# Altium schematic sheet 002-0081 Rev -.SchDoc
size B
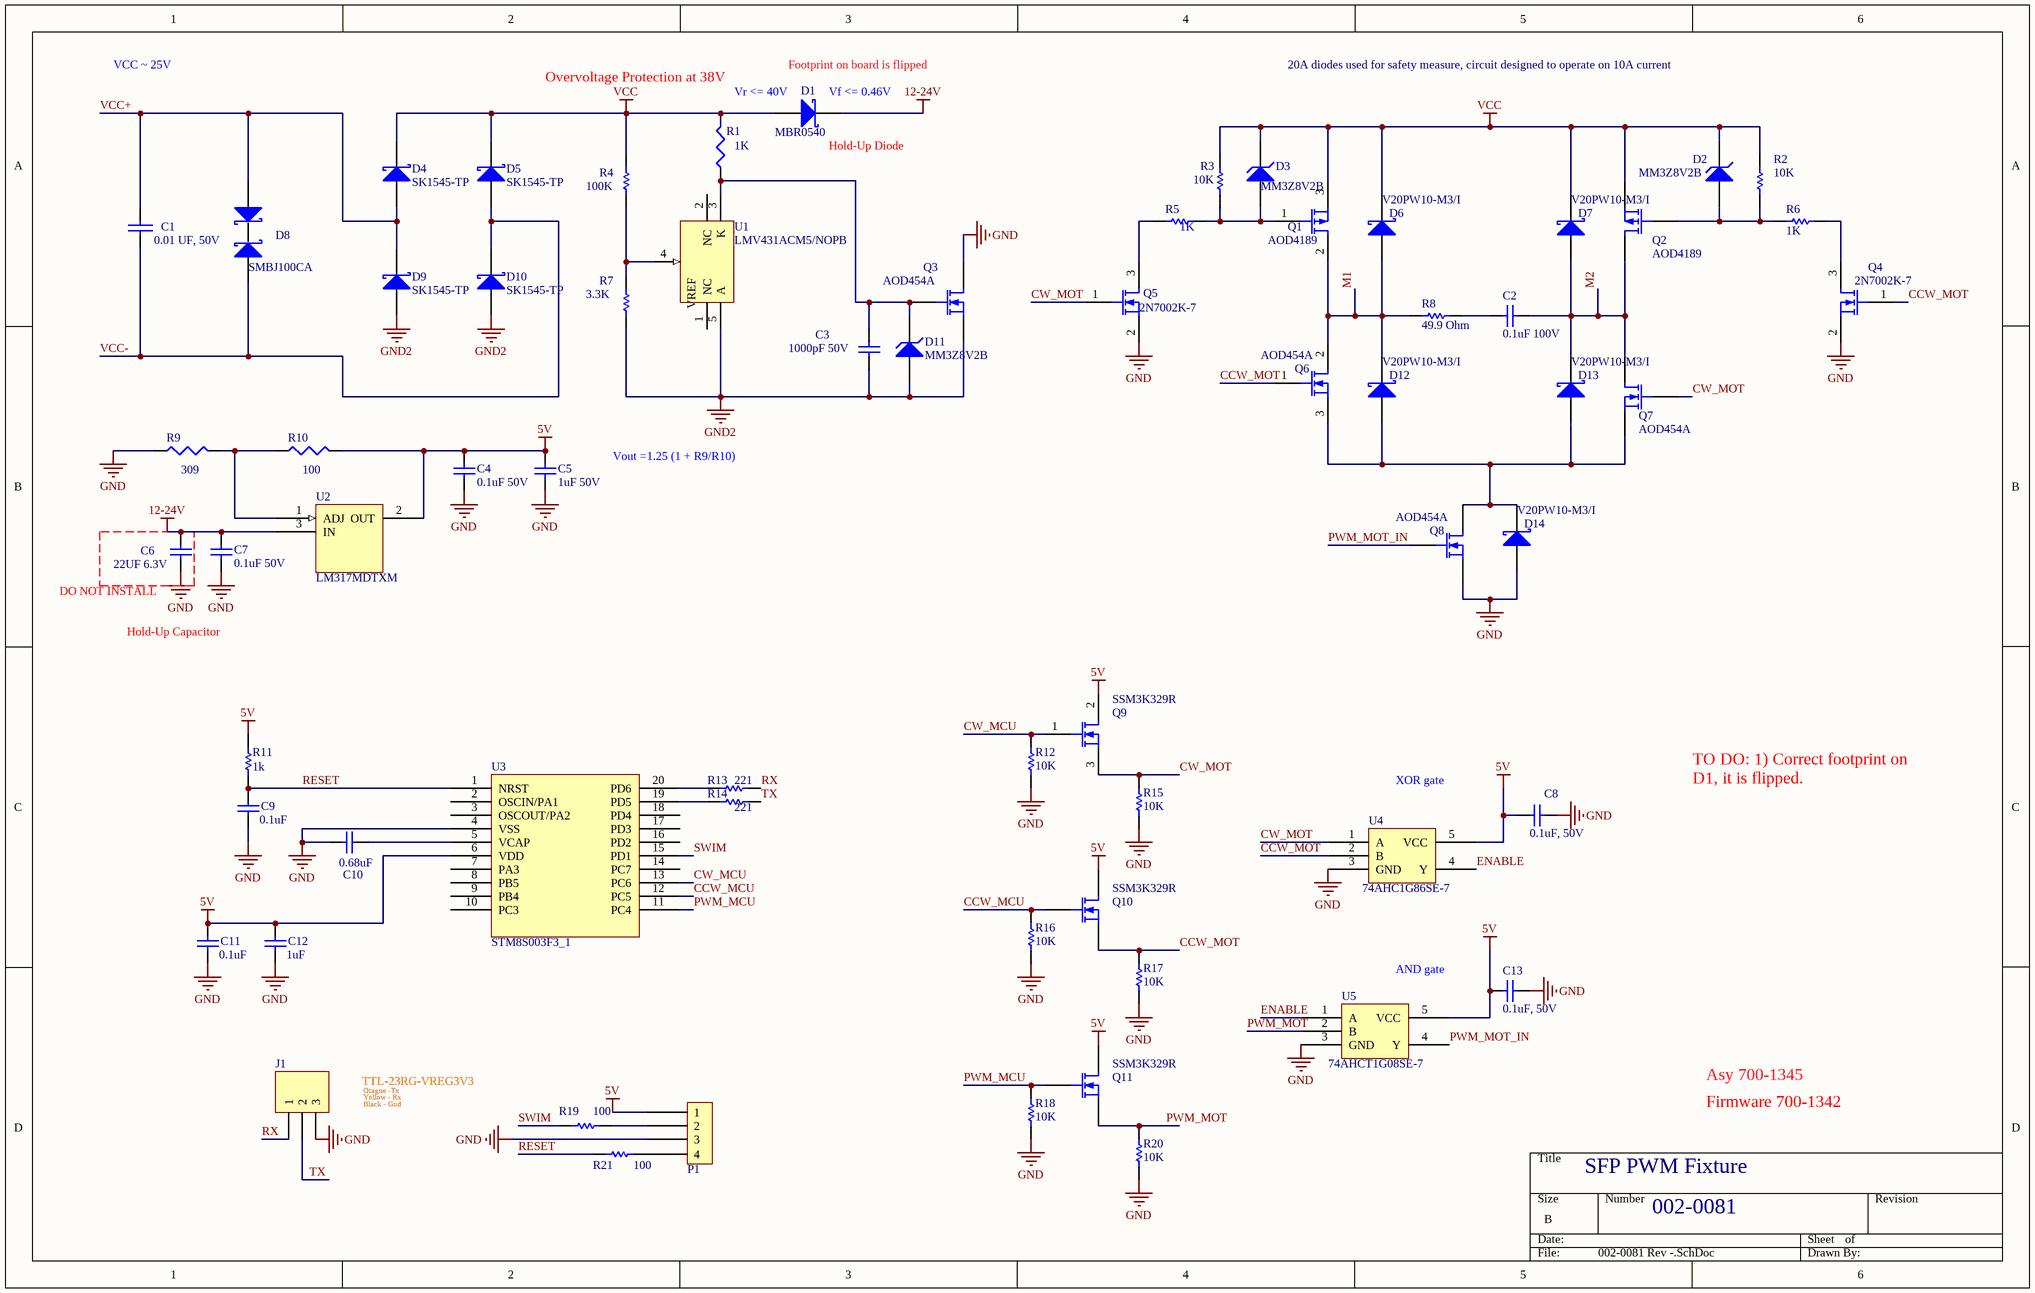
[diagram p0: 002-0081 Rev -.SchDoc]

## Parts
C1  0.01 UF, 50V  [0603]
C2  value 0.1uF 100V  [RESC0805(2012)_N]  (hidden comment: Cap)
C3  value 1000pF 50V  [0603]  (hidden comment: Cap)
C4  value 0.1uF 50V  [0603]  (hidden comment: Cap)
C5  value 1uF 50V  [0603]  (hidden comment: Cap)
C6  value 22UF 6.3V  [0603]  (hidden comment: Cap)
C7  value 0.1uF 50V  [0603]  (hidden comment: Cap)
C8  value 0.1uF, 50V  [0603]  (hidden comment: Cap)
C9  value 0.1uF  [CAPC0402(1005)60_M]  (hidden comment: Cap)
C10  value 0.68uF  [CAPC0402(1005)60_M]  (hidden comment: Cap)
C11  value 0.1uF  [CAPC0402(1005)60_M]  (hidden comment: Cap)
C12  value 1uF  [CAPC0402(1005)60_M]  (hidden comment: Cap)
C13  value 0.1uF, 50V  [0603]  (hidden comment: Cap)
D1  MBR0540  [SOD123/X.85]
D2  MM3Z8V2B  [SOD-323F]
D3  MM3Z8V2B  [SOD-323F]
D4  SK1545-TP  [SMC]
D5  SK1545-TP  [SMC]
D6  V20PW10-M3/I  [DPAK (TO-252-3)]
D7  V20PW10-M3/I  [DPAK (TO-252-3)]
D8  Part Number: SMBJ100CA  [SMB - Bidirection]  (hidden comment: TVS DIODE 28VWM 45.4VC SMB)
D9  SK1545-TP  [SMC]
D10  SK1545-TP  [SMC]
D11  MM3Z8V2B  [SOD-323F]
D12  V20PW10-M3/I  [DPAK (TO-252-3)]
D13  V20PW10-M3/I  [DPAK (TO-252-3)]
D14  V20PW10-M3/I  [DPAK (TO-252-3)]
J1  RS232 Conn  [SCON3/.10]  (value not drawn)
P1  4 Pin Connector  [4 PIN IN-LINE]  (value not drawn)
Q1  AOD4189  [DPAK (TO-252-3)]
Q2  AOD4189  [DPAK (TO-252-3)]
Q3  AOD454A  [DPAK (TO-252-3)]
Q4  2N7002K-7  [SOT-23-3]
Q5  2N7002K-7  [SOT-23-3]
Q6  AOD454A  [DPAK (TO-252-3)]
Q7  AOD454A  [DPAK (TO-252-3)]
Q8  AOD454A  [DPAK (TO-252-3)]
Q9  SSM3K329R  [SOT-23F]
Q10  SSM3K329R  [SOT-23F]
Q11  SSM3K329R  [SOT-23F]
R1  value 1K  [RESC0603(1608)_M]  (hidden comment: Res3)
R2  value 10K  [RESC0603(1608)_M]  (hidden comment: Res1)
R3  value 10K  [RESC0603(1608)_M]  (hidden comment: Res1)
R4  value 100K  [RESC0603(1608)_M]  (hidden comment: Res1)
R5  value 1K  [RESC0603(1608)_M]  (hidden comment: Res1)
R6  value 1K  [RESC0603(1608)_M]  (hidden comment: Res1)
R7  value 3.3K  [RESC0603(1608)_M]  (hidden comment: Res1)
R8  value 49.9 Ohm  [RESC0805(2012)_N]  (hidden comment: Res1)
R9  value 309  [J1-0603]  (hidden comment: Res3)
R10  value 100  [J1-0603]  (hidden comment: Res3)
R11  value 1k  [RESC0402(1005)_N]  (hidden comment: Res1)
R12  value 10K  [RESC0603(1608)_M]  (hidden comment: Res1)
R13  value 221  [RESC0402(1005)_N]  (hidden comment: Res1)
R14  value 221  [RESC0402(1005)_N]  (hidden comment: Res1)
R15  value 10K  [RESC0603(1608)_M]  (hidden comment: Res1)
R16  value 10K  [RESC0603(1608)_M]  (hidden comment: Res1)
R17  value 10K  [RESC0603(1608)_M]  (hidden comment: Res1)
R18  value 10K  [RESC0603(1608)_M]  (hidden comment: Res1)
R19  value 100  [RESC0402(1005)_N]  (hidden comment: Res1)
R20  value 10K  [RESC0603(1608)_M]  (hidden comment: Res1)
R21  value 100  [RESC0402(1005)_N]  (hidden comment: Res1)
U1  LMV431ACM5/NOPB  [DBV005]
U2  LM317MDTXM  [DPAK (TO-252-3)]
U3  STM8S003F3_1  [UFQFPN20_V]
U4  74AHC1G86SE-7  [SOT-353]
U5  74AHCT1G08SE-7  [SOT-353]

## Nets
5V: C4.2 C5.2 C8.2 C11.2 C12.2 C13.2 P1.1 Q9.2(D) Q10.2(D) Q11.2(D) R10.2 R11.2 U2.2(OUT) U3.6(VDD) U4.5(VCC) U5.5(VCC)
12-24V: C6.2 C7.2 D1.1(K) U2.3(IN)
GND: C4.1 C5.1 C6.1 C7.1 C8.1 C9.1 C10.1 C11.1 C12.1 C13.1 D14.1(A) J1.3 P1.3 Q3.2(D) Q4.2(S) Q5.2(S) Q8.3(S) R9.1 R12.2 R15.2 R16.2 R17.2 R18.2 R20.2 U3.4(VSS) U4.3(GND) U5.3(GND)
GND2: C3.1 D9.1(A) D10.1(A) D11.1(A) Q3.3(S) R7.2 U1.5(A)
VCC: D1.2(A) D2.2(K) D3.2(K) D4.2(K) D5.2(K) D6.2(K) D7.2(K) Q1.3(S) Q2.3(S) R1.2 R2.1 R3.1 R4.1
CCW_MCU: Q10.1(G) R16.1 U3.12(PC5)
CCW_MOT: Q4.1(G) Q6.1(G) Q10.3(S) R17.1 U4.2(B)
CW_MCU: Q9.1(G) R12.1 U3.13(PC6)
CW_MOT: Q5.1(G) Q7.1(G) Q9.3(S) R15.1 U4.1(A)
ENABLE: U4.4(Y) U5.1(A)
M1: D6.1(A) D12.2(K) Q1.2(D) Q6.2(D) R8.2
M2: C2.1 D7.1(A) D13.2(K) Q2.2(D) Q7.2(D)
PWM_MCU: Q11.1(G) R18.1 U3.11(PC4)
PWM_MOT: Q11.3(S) R20.1 U5.2(B)
PWM_MOT_IN: Q8.1(G) U5.4(Y)
RESET: C9.2 R11.1 R21.1 U3.1(NRST)
RX: J1.1 R13.2
SWIM: R19.1 U3.15(PD1)
TX: J1.2 R14.2
VCC+: C1.1 D4.1(A) D8.2 D9.2(K)
VCC-: C1.2 D5.1(A) D8.1 D10.2(K)
NetC2_2: C2.2 R8.1
NetC3_2: C3.2 D11.2(K) Q3.1(G) R1.1 U1.3(K)
NetC10_2: C10.2 U3.5(VCAP)
NetD2_1: D2.1(A) Q2.1(G) R2.2 R6.1
NetD3_1: D3.1(A) Q1.1(G) R3.2 R5.2
NetD12_1: D12.1(A) D13.1(A) D14.2(K) Q6.3(S) Q7.3(S) Q8.2(D)
NetP1_2: P1.2 R19.2
NetP1_4: P1.4 R21.2
NetQ4_3: Q4.3(D) R6.2
NetQ5_3: Q5.3(D) R5.1
NetR4_2: R4.2 R7.1 U1.4(REF)
NetR9_2: R9.2 R10.1 U2.1(ADJ)
NetR13_1: R13.1 U3.20(PD6)
NetR14_1: R14.1 U3.19(PD5)

Not connected (* = marked no-connect by the designer): U1 1(NC) 2(NC); U3 2(OSCIN/PA1) 3(OSCOUT/PA2) 7(PA3) 8(PB5) 9(PB4) 10(PC3) 14(PC7) 16(PD2) 17(PD3) 18(PD4)

## Notes on the sheet
- VCC ~ 25V
- Overvoltage Protection at 38V
- Vr <= 40V
- (near D1) Footprint on board is flipped
- (near D1) Vf <= 0.46V
- 20A diodes used for safety measure, circuit designed to operate on 10A current
- (near D1) Hold-Up Diode
- Vout =1.25 (1 + R9/R10)
- (near C6) DO NOT INSTALL
- Hold-Up Capacitor
- XOR gate
- TO DO: 1) Correct footprint on D1, it is flipped.
- AND gate
- (near J1) TTL-23RG-VREG3V3
- (near J1) Oragne -Tx
- (near J1) Yellow - Rx
- (near J1) Black - Gnd
- Asy 700-1345
- Firmware 700-1342
- SFP PWM Fixture
- 002-0081
- (in symbol TL431IDBVR) VREF

## Library data of the parts
C1 = CAP: Cap Cer .01uf 50V 0603 RoHS; PEM Part Number: EE-1293; Manufacturer: Garrett Electronics Corporation; Part Number: X7R0603HTTD103K
C2 = Cap: Cap Cer 0.1uF 100V 10% X7R 0805; Part Number: CL21B104KCFSFNE; PEM Part Number: EE-1659
C3 = Cap: CAP Cer, 0.1uF, 50V, 0603 X7R, 10%; Manufacturer Part Number: 06035C104KAT2A; PEM Part Number: EE-1343
C4 C7 = Cap: CAP Cer, 0.1uF, 50V, 0603 X7R, 10%; Manufacturer Part Number: 06035C104KAT2A; PEM Part Number: EE-1425
C5 = Cap: CAP CER 1UF 50V 10% X5R 0603; Manufacturer Part Number: 06035C104KAT2A; PEM Part Number: EE-1708
C6 = Cap: CAP CER 22UF 6.3V X5R 0603; Manufacturer Part Number: 06035C104KAT2A; PEM Part Number: EE-1981
C8 = Cap: CAP Cer, 0.1uF, 50V, 0603 X7R, 10%; PEM Part Number: EE-1425; Part Number: 06035C104KAT2A
C9 C11 = Cap: Cap Cer 0.1uF 10V 10% X5R 0402; Part Number: LMK105BJ104KV-F; PEM Part Number: EE-1661; Manufacturer: Taiyo Yuden
C10 = Cap: Cap cer 0.68uF 6.3V 5% X6S 0402; PEM Part Number: EE-1673; Part Number: CL05X684JQ5NNNC; Manufacturer: Samsung Electro-Mechanics
C12 = Cap: Cap Cer 1uF 10V 10% X5R 0402; Part Number: C1005X5R1V105M050BC; PEM Part Number: EE-1725; Manufacturer: TDK Corporation
C13 = Cap: Cap Cer 0.1uF 10V 10% X5R 0402; PEM Part Number: EE-1425; Part Number: 06035C104KAT2A
D1 = D Schottky: Diode Schottky 40V 500ma SOD-123; Manufacturer Part Number: MBR0540-TP; PEM Part Number: EE-1290
D2 D3 D11 = D Zener: DIODE ZENER 8.2V 200MW SOD323F; PEM Part Number: EE-1681; Manufacturer Part Number: MM3Z8V2B
D4 D5 D9 D10 = D Schottky: DIODE SCHOTTKY 45V 15A DO214AB; PEM Part Number: EE-2167; Revision: July-2002: Re-released for DXP Platform.; Part Number: SK1545-TP
D6 D7 D12-D14 = D Schottky: DIODE SCHOTTKY 100V 20A SLIMDPAK; PEM Part Number: EE-2166; Manufacturer Part Number: V20PW10-M3/I
D8 = Dual Zener: TVS DIODE 100VWM 162VC DO214AA; Manufacturer: ON Semiconductor; PEM Part Number: EE-1946
J1 = Header 3: CONN HDR VERT 3POS .100 TIN; PEM Part Number: EE-1116; Manufacturer: Phoenix Contact; Part Number: 70543-0037; LatestRevisionDate: 17-Jul-2002; LatestRevisionNote: Re-released for DXP Platform.; Publisher: Altium Limited
P1 = 4 Pin Connector: PEM Part Number: EE-1855; Part Number: GRPB501VWVN-RC; Manufacturer: Sullins Connector Solutions
Q1 Q2 = MOSFET-P: MOSFET P-CH 40V 40A TO252 DPAK; PEM Part Number: EE-1879; Manufacturer Part Number: AOD4189
Q3 = MOSFET-N: MOSFET N-CH 250V 16A D-PAK; PEM Part Number: EE-1898; Part Number: AOD454A
Q4 Q5 = MOSFET-N: MOSFET N-CH 60V 0.38A SOT23-3; PEM Part Number: EE-2053; Manufacturer Part Number: 2N7002K-7
Q6-Q8 = MOSFET-N: MOSFET N-CH 40V 20A TO252; Manufacturer: Alpha & Omega Semiconductor Inc.; PEM Part Number: EE-1898; Part Number: AOD454A
Q9 Q10 = MOSFET-N: N-Channel 30V 3.5A (Ta) 1W (Ta) Surface Mount SOT-23F; Manufacturer: Alpha & Omega Semiconductor Inc.; PEM Part Number: EE-1830; Part Number: SSM3K329R
Q11 = MOSFET-N: N-Channel 30V 3.5A (Ta) 1W (Ta) Surface Mount SOT-23F; Part Number: AOD454A; Manufacturer: Alpha & Omega Semiconductor Inc.; PEM Part Number: EE-1898
R1 = Res3: RES SMD 1K OHM 1% 1/10W 0603; PEM Part Number: EE-2066; Published: 8-Jun-2000; LatestRevisionDate: 29-May-2009; LatestRevisionNote: IPC-7351 Footprint Added.; PackageReference: J1-0603; Publisher: Altium Limited; PackageDescription: Chip Resistor
R2 R3 R12 R15-R18 R20 = Res1: Res 10K 0603 1% 1/10W RoHS; Part Number: RK73H1JTTD1002F; PEM Part Number: EE-1296
R4 = Res1: Res 100K 0603 1% 1/10W RoHS; Part Number: RK73H1JTTD1002F; PEM Part Number: EE-1295
R5 R6 = Res1: Res 1.0K 0603 1% 1/10W RoHS; Manufacturer Part Number: CRCW06031K00FKEA; PEM Part Number: EE-1297
R7 = Res1: RES 23.7K OHM 1/10W 1% 0603 SMD; Part Number: MCR03ERTF3301; PEM Part Number: EE-1730
R8 = Res1: Res 49.9R 0805 1% 1/8W; PEM Part Number: EE-1238; Part Number: 9C08052A49R9FKHFT; Manufacturer: Phycomp
R9 = Res3: Res 10K 0603 1% 1/10W RoHS; PEM Part Number: EE-1296; Part Number: RK73H1JTTD1002F
R10 = Res3: Res 3.3K 0603 1% 1/8W RoHS; PEM Part Number: EE-1730; Part Number: MCR03ERTF3301
R11 = Res1: Res 1K 0402 1% 1/16W RoHS; PEM Part Number: EE-1581; Part Number: CRCW04021K00FKED; Manufacturer: Vishay
R13 = Res1: RES SMD 221 OHM 1% 1/16W 0402; Part Number: RC1005F2210CS; PEM Part Number: EE-1798
R14 = Res1: Res 1K 0603 1% 1/10W RoHS; Part Number: RC1005F2210CS; PEM Part Number: EE-1798
R19 R21 = Res1: Res 100R 0402 1% 1/16W RoHs; PEM Part Number: EE-1588; Part Number: RC0402FR-07100RL; Manufacturer: Yageo
U1 = TL431IDBVR: IC VREF SHUNT ADJ SOT23-5; PEM Part Number: EE-1900; Part Number: LMV431ACM5/NOPB
U2 = LM317D2T(3): SMT, IC, Adjust Voltage Reg, 0.5A, 3TERM, TO-252, 40V diff max; PEM Part Number: EE-1248; Manufacturer: Fairchild Semiconductor; Part Number: LM317MDTXM
U3 = STM8S003F3_1: MCU 8BIT 8KB 16MHZ 20-UFQFPN; PEM Part Number: EE-1655; Part Number: STM8S003F3U6TR; Manufacturer: STMicroelectronics
U4 = NC7SZ08: IC GATE XOR 1CH 2-INP SOT353; PEM Part Number: EE-2165; Manufacturer: Diodes Incorporated; Part Number: 74AHC1G86SE-7
U5 = NC7SZ08: IC GATE AND 1CH 2-INP SOT-353; PEM Part Number: EE-1801; Manufacturer: Diodes Incorporated; Part Number: 74AHCT1G08SE-7